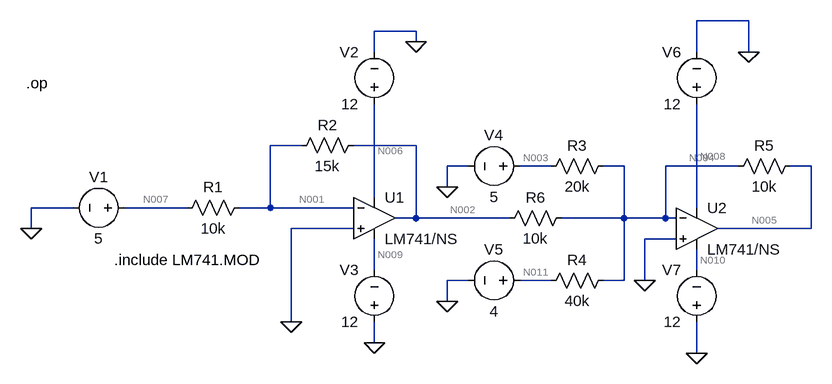
[diagram p0: schematic Pre10.asc]
Pre10.asc, the LTspice schematic file:
Version 4
SHEET 1 880 680
WIRE 672 -64 592 -64
WIRE 160 -48 96 -48
WIRE 160 -32 160 -48
WIRE 96 -16 96 -48
WIRE 592 -16 592 -64
WIRE 672 -16 672 -64
WIRE -16 128 -64 128
WIRE 160 128 64 128
WIRE 240 160 208 160
WIRE 368 160 320 160
WIRE 480 160 448 160
WIRE 656 160 544 160
WIRE 768 160 736 160
WIRE 208 192 208 160
WIRE 96 208 96 64
WIRE -368 224 -432 224
WIRE -192 224 -288 224
WIRE -64 224 -64 128
WIRE -64 224 -112 224
WIRE 64 224 -64 224
WIRE 592 224 592 64
WIRE 160 240 160 128
WIRE 160 240 128 240
WIRE 304 240 160 240
WIRE 480 240 480 160
WIRE 480 240 384 240
WIRE 544 240 544 160
WIRE 544 240 480 240
WIRE 560 240 544 240
WIRE -432 256 -432 224
WIRE 64 256 -32 256
WIRE 768 256 768 160
WIRE 768 256 624 256
WIRE 560 272 512 272
WIRE 96 320 96 272
WIRE 592 320 592 288
WIRE 240 336 208 336
WIRE 368 336 320 336
WIRE 480 336 480 240
WIRE 480 336 448 336
WIRE 512 336 512 272
WIRE 208 368 208 336
WIRE -32 400 -32 256
WIRE 96 432 96 400
WIRE 592 448 592 400
FLAG 160 -32 0
FLAG 96 432 0
FLAG -32 400 0
FLAG 208 368 0
FLAG 208 192 0
FLAG 672 -16 0
FLAG 592 448 0
FLAG -432 256 0
FLAG 512 336 0
SYMBOL OpAmps\\opamp2 96 176 R0
SYMATTR InstName U1
SYMATTR Value LM741/NS
SYMBOL OpAmps\\opamp2 592 192 R0
SYMATTR InstName U2
SYMATTR Value LM741/NS
SYMBOL res -96 208 R90
WINDOW 0 0 56 VBottom 2
WINDOW 3 32 56 VTop 2
SYMATTR InstName R1
SYMATTR Value 10k
SYMBOL res 80 112 R90
WINDOW 0 0 56 VBottom 2
WINDOW 3 32 56 VTop 2
SYMATTR InstName R2
SYMATTR Value 15k
SYMBOL voltage 96 80 R180
WINDOW 0 24 96 Left 2
WINDOW 3 24 16 Left 2
WINDOW 123 0 0 Left 0
WINDOW 39 0 0 Left 0
SYMATTR InstName V2
SYMATTR Value 12
SYMBOL voltage 96 416 R180
WINDOW 0 24 96 Left 2
WINDOW 3 24 16 Left 2
WINDOW 123 0 0 Left 0
WINDOW 39 0 0 Left 0
SYMATTR InstName V3
SYMATTR Value 12
SYMBOL voltage 336 160 R90
WINDOW 0 -32 56 VBottom 2
WINDOW 3 32 56 VTop 2
WINDOW 123 0 0 Left 0
WINDOW 39 0 0 Left 0
SYMATTR InstName V4
SYMATTR Value 5
SYMBOL voltage 336 336 R90
WINDOW 0 -32 56 VBottom 2
WINDOW 3 32 56 VTop 2
WINDOW 123 0 0 Left 0
WINDOW 39 0 0 Left 0
SYMATTR InstName V5
SYMATTR Value 4
SYMBOL res 464 144 R90
WINDOW 0 0 56 VBottom 2
WINDOW 3 32 56 VTop 2
SYMATTR InstName R3
SYMATTR Value 20k
SYMBOL res 464 320 R90
WINDOW 0 0 56 VBottom 2
WINDOW 3 32 56 VTop 2
SYMATTR InstName R4
SYMATTR Value 40k
SYMBOL res 752 144 R90
WINDOW 0 0 56 VBottom 2
WINDOW 3 32 56 VTop 2
SYMATTR InstName R5
SYMATTR Value 10k
SYMBOL voltage 592 80 R180
WINDOW 0 24 96 Left 2
WINDOW 3 24 16 Left 2
WINDOW 123 0 0 Left 0
WINDOW 39 0 0 Left 0
SYMATTR InstName V6
SYMATTR Value 12
SYMBOL voltage 592 416 R180
WINDOW 0 24 96 Left 2
WINDOW 3 24 16 Left 2
WINDOW 123 0 0 Left 0
WINDOW 39 0 0 Left 0
SYMATTR InstName V7
SYMATTR Value 12
SYMBOL res 400 224 R90
WINDOW 0 0 56 VBottom 2
WINDOW 3 32 56 VTop 2
SYMATTR InstName R6
SYMATTR Value 10k
SYMBOL voltage -272 224 R90
WINDOW 0 -32 56 VBottom 2
WINDOW 3 32 56 VTop 2
WINDOW 123 0 0 Left 0
WINDOW 39 0 0 Left 0
SYMATTR InstName V1
SYMATTR Value 5
TEXT -304 304 Left 2 !.include LM741.MOD
TEXT -440 32 Left 2 !.op

The netlist it stands for:
* Pre10.asc
XU1 0 N001 N006 N009 N002 LM741/NS  ; pins In+ In- V+ V- OUT
XU2 0 N004 N008 N010 N005 LM741/NS  ; pins In+ In- V+ V- OUT
R1 N001 N007 10k
R2 N002 N001 15k
V2 N006 0 12
V3 0 N009 12
V4 N003 0 5
V5 N011 0 4
R3 N004 N003 20k
R4 N004 N011 40k
R5 N005 N004 10k
V6 N008 0 12
V7 0 N010 12
R6 N004 N002 10k
V1 N007 0 5
.include LM741.MOD
.op
.backanno
.end

* Results of the author's LTspice run, read from the files saved beside the schematic
* Operating Point:
*   V(n001) = 1.038 mV
*   V(n009) = -12 V
*   V(n006) = 12 V
*   V(n002) = -7.496 V
*   V(n004) = 979.8 µV
*   V(n010) = -12 V
*   V(n008) = 12 V
*   V(n005) = 4 V
*   V(n007) = 5 V
*   V(n003) = 5 V
*   V(n011) = 4 V
*   I(R1) = -499.9 µA
*   I(R2) = -499.8 µA
*   I(R3) = -250 µA
*   I(R4) = -99.98 µA
*   I(R5) = 399.9 µA
*   I(R6) = 749.7 µA
*   I(V2) = -1.551 mA
*   I(V3) = -2.801 mA
*   I(V4) = -250 µA
*   I(V5) = -99.98 µA
*   I(V6) = -1.961 mA
*   I(V7) = -1.561 mA
*   I(V1) = -499.9 µA
*   Ix(u1:1) = 57.73 nA
*   Ix(u1:2) = 102 nA
*   Ix(u1:99) = 1.551 mA
*   Ix(u1:50) = -2.801 mA
*   Ix(u1:28) = 1.249 mA
*   Ix(u2:1) = 57.93 nA
*   Ix(u2:2) = 101.8 nA
*   Ix(u2:99) = 1.961 mA
*   Ix(u2:50) = -1.561 mA
*   Ix(u2:28) = -399.9 µA
* From the log:
*   Semiconductor Device Operating Points:
*                           --- Diodes ---
*   Name:    d:u1:1      d:u1:2      d:u1:5      d:u1:6      d:u1:4
*   Model:    u1:dx       u1:dx       u1:dx       u1:dx       u1:dx
*   Id:     -1.80e-11   -2.77e-12    1.25e-03    1.60e-06   -7.92e-14
*   Vd:     -1.80e+01   -2.77e+00    7.20e-01    5.48e-01   -7.83e-02
*   Req:     1.00e+12    1.00e+12    2.07e+01    1.61e+04    9.98e+11
*   CAP:     0.00e+00    0.00e+00    0.00e+00    0.00e+00    0.00e+00
*   Name:    d:u1:3      d:u2:1      d:u2:2      d:u2:5      d:u2:6
*   Model:    u1:dx       u2:dx       u2:dx       u2:dx       u2:dx
*   Id:     -2.83e-13   -6.32e-12   -1.44e-11    1.09e-05    4.11e-04
*   Vd:     -2.82e-01   -6.32e+00   -1.44e+01    5.98e-01    6.92e-01
*   Req:     1.00e+12    1.00e+12    1.00e+12    2.37e+03    6.30e+01
*   CAP:     0.00e+00    0.00e+00    0.00e+00    0.00e+00    0.00e+00
*   Name:    d:u2:4      d:u2:3
*   Model:    u2:dx       u2:dx
*   Id:     -2.33e-13   -1.29e-13
*   Vd:     -2.32e-01   -1.28e-01
*   Req:     1.00e+12    1.00e+12
*   CAP:     0.00e+00    0.00e+00
*                           --- Bipolar Transistors ---
*   Name:     q:u1:1      q:u1:2      q:u2:1      q:u2:2
*   Model:     u1:qx       u1:qx       u2:qx       u2:qx
*   Ib:       7.99e-08    7.98e-08    7.98e-08    7.99e-08
*   Ic:       5.00e-05    4.99e-05    4.99e-05    4.99e-05
*   Vbe:      6.97e-01    6.97e-01    6.97e-01    6.97e-01
*   Vbc:     -1.20e+01   -1.20e+01   -1.20e+01   -1.20e+01
*   Vce:      1.27e+01    1.27e+01    1.27e+01    1.27e+01
*   BetaDC:   6.25e+02    6.25e+02    6.25e+02    6.25e+02
*   Gm:       1.93e-03    1.93e-03    1.93e-03    1.93e-03
*   Rpi:      3.24e+05    3.24e+05    3.24e+05    3.24e+05
*   Rx:       0.00e+00    0.00e+00    0.00e+00    0.00e+00
*   Ro:       0.00e+00    0.00e+00    0.00e+00    0.00e+00
*   Cbe:      0.00e+00    0.00e+00    0.00e+00    0.00e+00
*   Cbc:      0.00e+00    0.00e+00    0.00e+00    0.00e+00
*   Cjs:      0.00e+00    0.00e+00    0.00e+00    0.00e+00
*   BetaAC:   6.25e+02    6.25e+02    6.25e+02    6.25e+02
*   Cbx:      0.00e+00    0.00e+00    0.00e+00    0.00e+00
*   Ft:       0.00e+00    0.00e+00    0.00e+00    0.00e+00